# Altium schematic sheet MCU_STM32F103RBT6.SchDoc
size 393 x 281 mm; SheetNumber: 3; SheetTotal: 6
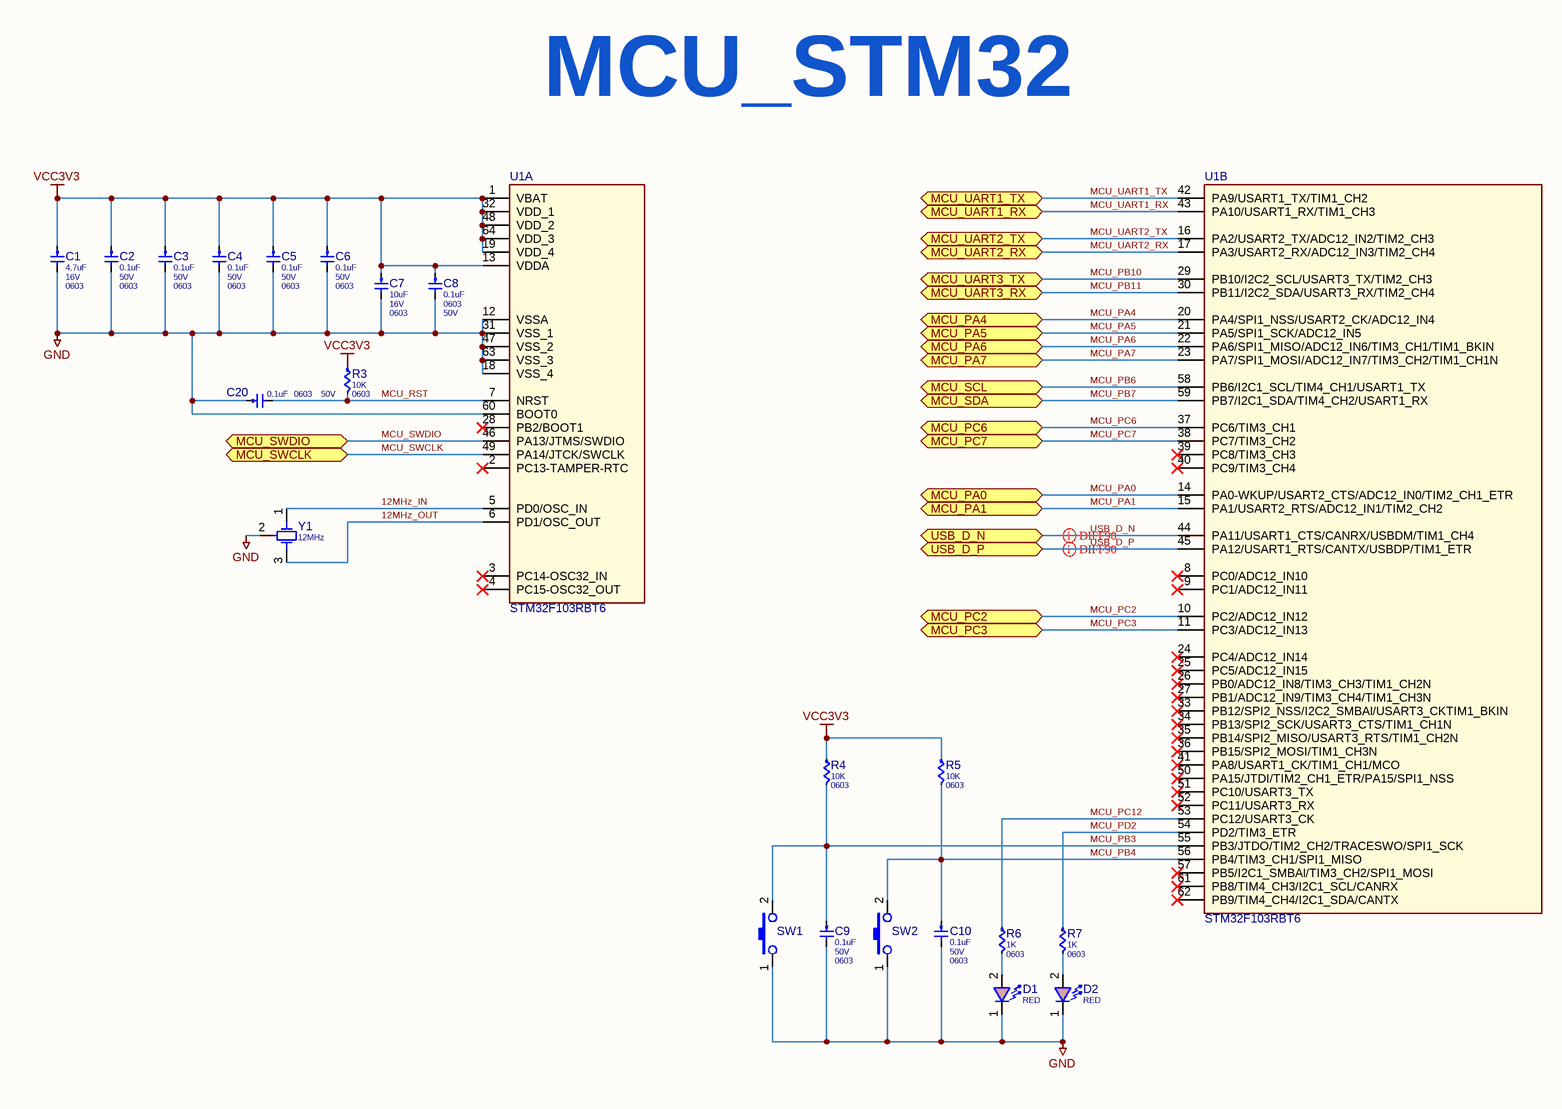
[diagram p0: MCU_STM32F103RBT6.SchDoc]

## Parts
C1  value 4.7uF  VOLTAGE: 16V  PACK: 0603  [C0603]  (hidden comment: 4.7uF 16V 0603)
C2  value 0.1uF  VOLTAGE: 50V  PACK: 0603  [C0603]  (hidden comment: 0.1uF 50V 0603)
C3  value 0.1uF  VOLTAGE: 50V  PACK: 0603  [C0603]  (hidden comment: 0.1uF 50V 0603)
C4  value 0.1uF  VOLTAGE: 50V  PACK: 0603  [C0603]  (hidden comment: 0.1uF 50V 0603)
C5  value 0.1uF  VOLTAGE: 50V  PACK: 0603  [C0603]  (hidden comment: 0.1uF 50V 0603)
C6  value 0.1uF  VOLTAGE: 50V  PACK: 0603  [C0603]  (hidden comment: 0.1uF 50V 0603)
C7  value 10uF  VOLTAGE: 16V  PACK: 0603  [C0603]  (hidden comment: 10uF 16V 0603)
C8  value 0.1uF  PACK: 0603  VOLTAGE: 50V  [C0603]  (hidden comment: 0.1uF 50V 0603)
C9  value 0.1uF  VOLTAGE: 50V  PACK: 0603  [C0603]  (hidden comment: 0.1uF 50V 0603)
C10  value 0.1uF  VOLTAGE: 50V  PACK: 0603  [C0603]  (hidden comment: 0.1uF 50V 0603)
C20  value 0.1uF  PACK: 0603  VOLTAGE: 50V  [C0603]  (hidden comment: 0.1uF 50V 0603)
D1  COLOR: RED  [LED0805_RED]  (hidden comment: LH R974-LP-1)
D2  COLOR: RED  [LED0805_RED]  (hidden comment: LH R974-LP-1)
R3  value 10K  PACK: 0603  [R0603]  (hidden comment: 10K 0603)
R4  value 10K  PACK: 0603  [R0603]  (hidden comment: 10K 0603)
R5  value 10K  PACK: 0603  [R0603]  (hidden comment: 10K 0603)
R6  value 1K  PACK: 0603  [R0603]  (hidden comment: 1K 0603)
R7  value 1K  PACK: 0603  [R0603]  (hidden comment: 1K 0603)
SW1  BTN 3x6x5 SMD  [BTN_6L3W5H]  (value not drawn)
SW2  BTN 3x6x5 SMD  [BTN_6L3W5H]  (value not drawn)
U1  STM32F103RBT6  [64LQFP]  (parts A,B of 2)
Y1  value 12MHz  [CRYS_3-SMD]  (hidden comment: CSTNE12M0G550000R0)

## Ports
MCU_PA0 (bidir), MCU_PA1 (bidir), MCU_PA4 (bidir), MCU_PA5 (bidir), MCU_PA6 (bidir), MCU_PA7 (bidir), MCU_PC2 (bidir), MCU_PC3 (bidir), MCU_PC6 (bidir), MCU_PC7 (bidir), MCU_SCL (bidir), MCU_SDA (bidir), MCU_SWCLK (bidir), MCU_SWDIO (bidir), MCU_UART1_RX (bidir), MCU_UART1_TX (bidir), MCU_UART2_RX (bidir), MCU_UART2_TX (bidir), MCU_UART3_RX (bidir), MCU_UART3_TX (bidir), USB_D_N (bidir), USB_D_P (bidir)

## Nets
GND: C1.2 C2.2 C3.2 C4.2 C5.2 C6.2 C7.2 C8.2 C9.2 C10.2 C20.1 D1.1(K) D2.1(K) SW1.1(1,2) SW2.1(1,2) U1.12(VSSA) U1.18(VSS_4) U1.31(VSS_1) U1.47(VSS_2) U1.60(BOOT0) U1.63(VSS_3) Y1.2(GND)
VCC3V3: C1.1 C2.1 C3.1 C4.1 C5.1 C6.1 C7.1 C8.1 R3.1 R4.1 R5.1 U1.1(VBAT) U1.13(VDDA) U1.19(VDD_4) U1.32(VDD_1) U1.48(VDD_2) U1.64(VDD_3)
12MHz_IN: U1.5(PD0/OSC_IN) Y1.1(IN)
12MHz_OUT: U1.6(PD1/OSC_OUT) Y1.3(OUT)
MCU_PA0: U1.14(PA0-WKUP/USART2_CTS/ADC12_IN0/TIM2_CH1_ETR) ; port MCU_PA0
MCU_PA1: U1.15(PA1/USART2_RTS/ADC12_IN1/TIM2_CH2) ; port MCU_PA1
MCU_PA4: U1.20(PA4/SPI1_NSS/USART2_CK/ADC12_IN4) ; port MCU_PA4
MCU_PA5: U1.21(PA5/SPI1_SCK/ADC12_IN5) ; port MCU_PA5
MCU_PA6: U1.22(PA6/SPI1_MISO/ADC12_IN6/TIM3_CH1/TIM1_BKIN) ; port MCU_PA6
MCU_PA7: U1.23(PA7/SPI1_MOSI/ADC12_IN7/TIM3_CH2/TIM1_CH1N) ; port MCU_PA7
MCU_PB3: C9.1 R4.2 SW1.2(3,4) U1.55(PB3/JTDO/TIM2_CH2/TRACESWO/SPI1_SCK)
MCU_PB4: C10.1 R5.2 SW2.2(3,4) U1.56(PB4/TIM3_CH1/SPI1_MISO)
MCU_PB6: U1.58(PB6/I2C1_SCL/TIM4_CH1/USART1_TX) ; port MCU_SCL
MCU_PB7: U1.59(PB7/I2C1_SDA/TIM4_CH2/USART1_RX) ; port MCU_SDA
MCU_PB10: U1.29(PB10/I2C2_SCL/USART3_TX/TIM2_CH3) ; port MCU_UART3_TX
MCU_PB11: U1.30(PB11/I2C2_SDA/USART3_RX/TIM2_CH4) ; port MCU_UART3_RX
MCU_PC2: U1.10(PC2/ADC12_IN12) ; port MCU_PC2
MCU_PC3: U1.11(PC3/ADC12_IN13) ; port MCU_PC3
MCU_PC6: U1.37(PC6/TIM3_CH1) ; port MCU_PC6
MCU_PC7: U1.38(PC7/TIM3_CH2) ; port MCU_PC7
MCU_PC12: R6.1 U1.53(PC12/USART3_CK)
MCU_PD2: R7.1 U1.54(PD2/TIM3_ETR)
MCU_RST: C20.2 R3.2 U1.7(NRST)
MCU_SWCLK: U1.49(PA14/JTCK/SWCLK) ; port MCU_SWCLK
MCU_SWDIO: U1.46(PA13/JTMS/SWDIO) ; port MCU_SWDIO
MCU_UART1_RX: U1.43(PA10/USART1_RX/TIM1_CH3) ; port MCU_UART1_RX
MCU_UART1_TX: U1.42(PA9/USART1_TX/TIM1_CH2) ; port MCU_UART1_TX
MCU_UART2_RX: U1.17(PA3/USART2_RX/ADC12_IN3/TIM2_CH4) ; port MCU_UART2_RX
MCU_UART2_TX: U1.16(PA2/USART2_TX/ADC12_IN2/TIM2_CH3) ; port MCU_UART2_TX
USB_D_N: U1.44(PA11/USART1_CTS/CANRX/USBDM/TIM1_CH4) ; port USB_D_N
USB_D_P: U1.45(PA12/USART1_RTS/CANTX/USBDP/TIM1_ETR) ; port USB_D_P
NetD1_2: D1.2(A) R6.2
NetD2_2: D2.2(A) R7.2

Not connected (* = marked no-connect by the designer): U1 2(PC13-TAMPER-RTC)* 3(PC14-OSC32_IN)* 4(PC15-OSC32_OUT)* 8(PC0/ADC12_IN10)* 9(PC1/ADC12_IN11)* 24(PC4/ADC12_IN14)* 25(PC5/ADC12_IN15)* 26(PB0/ADC12_IN8/TIM3_CH3/TIM1_CH2N)* 27(PB1/ADC12_IN9/TIM3_CH4/TIM1_CH3N)* 28(PB2/BOOT1)* 33(PB12/SPI2_NSS/I2C2_SMBAl/USART3_CKTIM1_BKIN)* 34(PB13/SPI2_SCK/USART3_CTS/TIM1_CH1N)* 35(PB14/SPI2_MISO/USART3_RTS/TIM1_CH2N)* 36(PB15/SPI2_MOSI/TIM1_CH3N)* 39(PC8/TIM3_CH3)* 40(PC9/TIM3_CH4)* 41(PA8/USART1_CK/TIM1_CH1/MCO)* 50(PA15/JTDI/TIM2_CH1_ETR/PA15/SPI1_NSS)* 51(PC10/USART3_TX)* 52(PC11/USART3_RX)* 57(PB5/I2C1_SMBAl/TIM3_CH2/SPI1_MOSI)* 61(PB8/TIM4_CH3/I2C1_SCL/CANRX)* 62(PB9/TIM4_CH4/I2C1_SDA/CANTX)*

## Layout directives
differential pair; net class DIFF90: USB_D_N, USB_D_P

## Notes on the sheet
- MCU_STM32
- Title:
- Size:
- A3
- Date Modified:
- Document Number:
- Rev:
- Engineer:
- Sheet
- Of

## Library data of the parts
C1 = C0603_4.7uF_16V_20%: CAP CER 4.7UF 20% 16V X5R 0603 SMD; MGR: Murata Electronics; MGR PN: GRM188R61C475ME11D; Group: CAP CER; Line Type: SMT; Unit: PCS; TYPE: CAP; Mounting Type: SMD; PHX PN: *; PHX CODE: *; NOTE: *; SAP code: *; Part Code: *; Part Type: EP; TEMP: X5R; TOLERANCE: 20%
C2-C6 C8-C10 C20 = C0603_0.1uF_50V_10%: CAP CER 0.1UF 10% 50V X7R 0603 SMD; MGR: Murata Electronics; MGR PN: GCM188R71H104KA57D; Group: CAP CER; Line Type: SMT; Unit: PCS; TYPE: CAP; Mounting Type: SMD; PHX PN: *; PHX CODE: *; NOTE: *; SAP code: *; Part Code: *; Part Type: EP; TEMP: X7R; TOLERANCE: 10%
C7 = C0603_10uF_16V_10%: CAP CER 10UF 10% 16V X5R 0603 SMD; MGR: Murata Electronics; MGR PN: GRM188R61C106KAALJ; Group: CAP CER; Line Type: SMT; Unit: PCS; TYPE: CAP; Mounting Type: SMD; PHX PN: *; PHX CODE: *; NOTE: *; SAP code: *; Part Code: *; Part Type: EP; TEMP: X5R; TOLERANCE: 10%
D1 D2 = LED0805_RED: LED IND RED 1.8V 20mA 0805 SMD; MGR: OSRAM; Group: LED IND; Line Type: SMT; Unit: PCS; PACK: 0805; TYPE: LED; Mounting Type: SMD; PHX PN: *; PHX CODE: *; NOTE: *; SAP code: *; Part Code: *; Part Type: EP; VF(V): 1.8V; IF(mA): 20mA; MGR PN: LH R974-LP-1
R3-R5 = R0603_10K_1/10W_1%: RES CHP 10K 1% 1/10W 0603 SMD; MGR: PANASONIC; MGR PN: ERJ-3EKF1002V; Group: RES CHP; Line Type: SMT; Unit: PCS; TYPE: RES; Mounting Type: SMD; PHX PN: *; PHX CODE: *; NOTE: *; SAP code: *; Part Code: *; Part Type: EP; POWER: 1/10W; TOLERANCE: 1%
R6 R7 = R0603_1K_1/10W_1%: RES CHP 1K 1% 1/10W 0603 SMD; MGR: PANASONIC; MGR PN: ERJ-3EKF1001V; Group: RES CHP; Line Type: SMT; Unit: PCS; TYPE: RES; Mounting Type: SMD; PHX PN: *; PHX CODE: *; NOTE: *; SAP code: *; Part Code: *; Part Type: EP; POWER: 1/10W; TOLERANCE: 1%
SW1 SW2 = SWT_BTN_3x6x5: SWT BTN 3x6x5 SMD; MGR: BANLINHKIEN; Group: SWT BTN; Line Type: SMT; PACK: 6L3W5H; Unit: PCS; TYPE: SWT; Mounting Type: SMD; PHX PN: *; PHX CODE: *; NOTE: *; SAP code: *; Part Code: *; Part Type: EP; MGR PN: BTN 3x6x5 SMD
U1 = IC_STM32F103RBT6: ICS EMB MCU 32BIT 128KB FLASH 64LQFP SMD; MGR: STMicroelectronics; Group: ICS EMB; Line Type: SMT; Unit: PCS; Voltage: 2~3.6V; Core Size: 32-Bit; TYPE: ICS; Level: *; Layer: *; PACK: 64LQFP; Mounting Type: SMD; PHX PN: *; PHX CODE: *; NOTE: *; SAP code: *; Part Code: *; Part Type: EP; Flash Size: 128KB; MGR PN: STM32F103RBT6
Y1 = CRYS_CSTNE12M0G550000R0: CRYSTAL 12MHZ 33PF 3.2L1.3W0.8H SMD; MGR: Murata Electronics; Line Type: SMT; Unit: PCS; Frequency Tolerance: 0.5%; Frequency Stability: 0.2%; TYPE: CRYS; Group: CRYSTAL; PACK: 3.2L1.3W0.8H; Mounting Type: SMD; PHX PN: *; PHX CODE: *; NOTE: *; SAP code: *; Part Code: *; Part Type: EP; Footprint: ABM10; LOAD CAP: 33pF; MGR PN: CSTNE12M0G550000R0